# EAGLE design powerSupplyV1 (EAGLE 6.4)
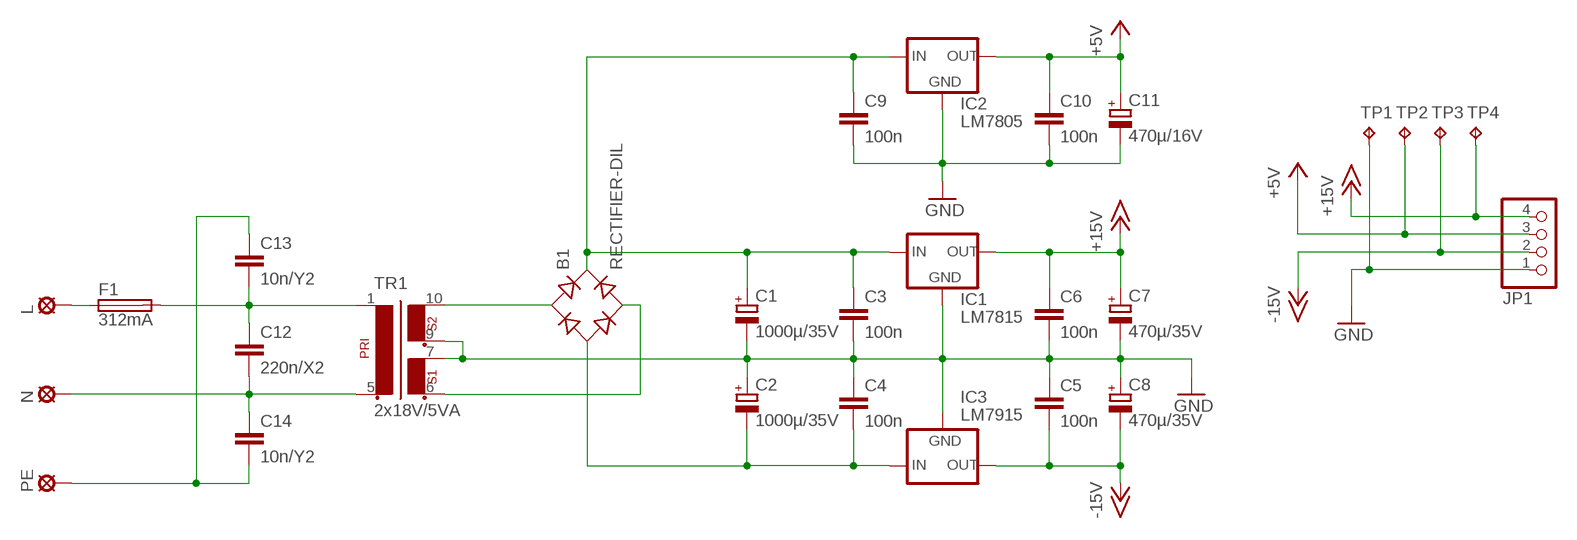
[diagram p0: schematic, sheet 1]

## Parts
B1  RECTIFIER-DIL  [B-DIL]
C1  1000µ/35V  CPOL-EUE5-13  [E5-13]
C2  1000µ/35V  CPOL-EUE5-13  [E5-13]
C3  100n  C-EUC0603K  [C0603K]
C4  100n  C-EUC0603K  [C0603K]
C5  100n  C-EUC0603K  [C0603K]
C6  100n  C-EUC0603K  [C0603K]
C7  470µ/35V  CPOL-EUE5-10.5  [E5-10,5]
C8  470µ/35V  CPOL-EUE5-10.5  [E5-10,5]
C9  100n  C-EUC0603K  [C0603K]
C10  100n  C-EUC0603K  [C0603K]
C11  470µ/16V  CPOL-EUE5-10.5  [E5-10,5]
C12  220n/X2  C-EU225-062X268  [C225-062X268]
C13  10n/Y2  C-EU150-054X183  [C150-054X183]
C14  10n/Y2  C-EU150-054X183  [C150-054X183]
F1  312mA  SH22,5  [SH22,5]
IC1  LM7815  78XXS  [78XXS]
IC2  LM7805  78XXS  [78XXS]
IC3  LM7915  79XXS  [79XXS]
JP1  PINHD-1X4  [1X04]
L  L  SE14  [SE14]
N  SE14  [SE14]
PE  SE14  [SE14]
TP1  TPB2,54  [B2,54]
TP2  TPB2,54  [B2,54]
TP3  TPB2,54  [B2,54]
TP4  TPB2,54  [B2,54]
TR1  2x18V/5VA  EI42-2  [EI42-2]

## Nets
+5V: C10.1 C11.+ IC2.OUT JP1.3 TP2.TP
+15V: C6.1 C7.+ IC1.OUT JP1.4 TP4.TP
-15V: C5.2 C8.- IC3.OUT JP1.2 TP3.TP
GND: C1.- C2.+ C3.2 C4.1 C5.1 C6.2 C7.- C8.+ C9.2 C10.2 C11.- IC1.GND IC2.GND IC3.GND JP1.1 TP1.TP TR1.7 TR1.9
N$1: B1.AC1 TR1.10
N$2: B1.AC2 TR1.6
N$3: C12.1 C13.2 F1.2 TR1.1
N$4: B1.- C2.- C4.2 IC3.IN
N$5: B1.+ C1.+ C3.1 C9.1 IC1.IN IC2.IN
N$6: C12.2 C14.1 N.MP TR1.5
N$7: C13.1 C14.2 PE.MP
N$9: F1.1 L.MP

## Library data of the parts
B1 = rectifier:RECTIFIER-: Rectifier
C1 C2 C7 C8 C11 = rcl:CPOL-EU: POLARIZED CAPACITOR, European symbol
C3-C6 C9 C10 C12-C14 = rcl:C-EU: CAPACITOR, European symbol
F1 = fuse:SH22,5: FUSE HOLDER grid 22,5 mm, OGN0031 8201, Schurter (Buerklin); MF: SCHURTER; MPN: 0031.8201; OC_FARNELL: 1162740; OC_NEWARK: 96F8317
IC1 IC2 = v-reg:78XXS: VOLTAGE REGULATOR
IC3 = v-reg:79XXS: VOLTAGE REGULATOR
JP1 = pinhead:PINHD-1X4: PIN HEADER
L N PE = solpad:SE14: SOLDER PAD E1553, drill 1,4mm, distributor Buerklin, 07F820
TP1-TP4 = testpad:TP: Test pad
TR1 = trafo:EI42-2: TRANSFORMER 1 primary winding, 2 secondary windings ERA

## Board
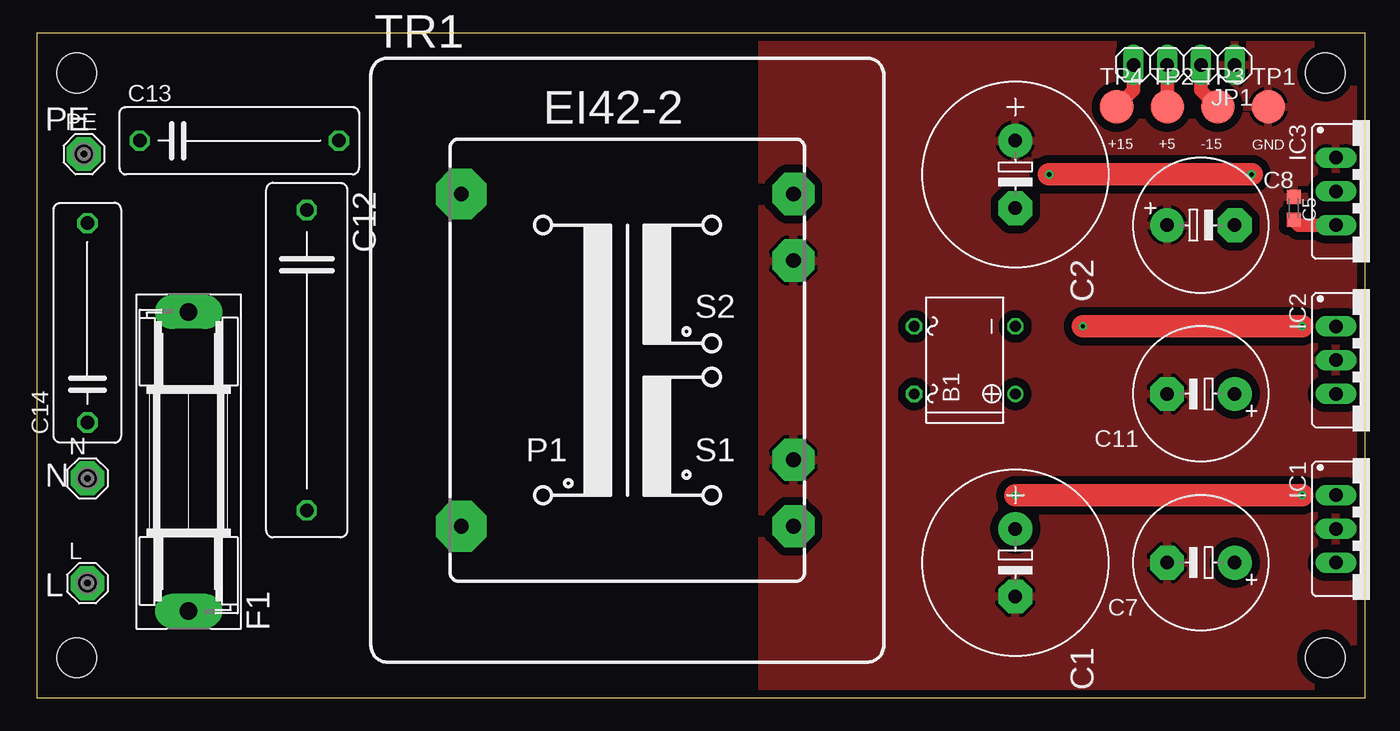
[diagram p1: board, top side]
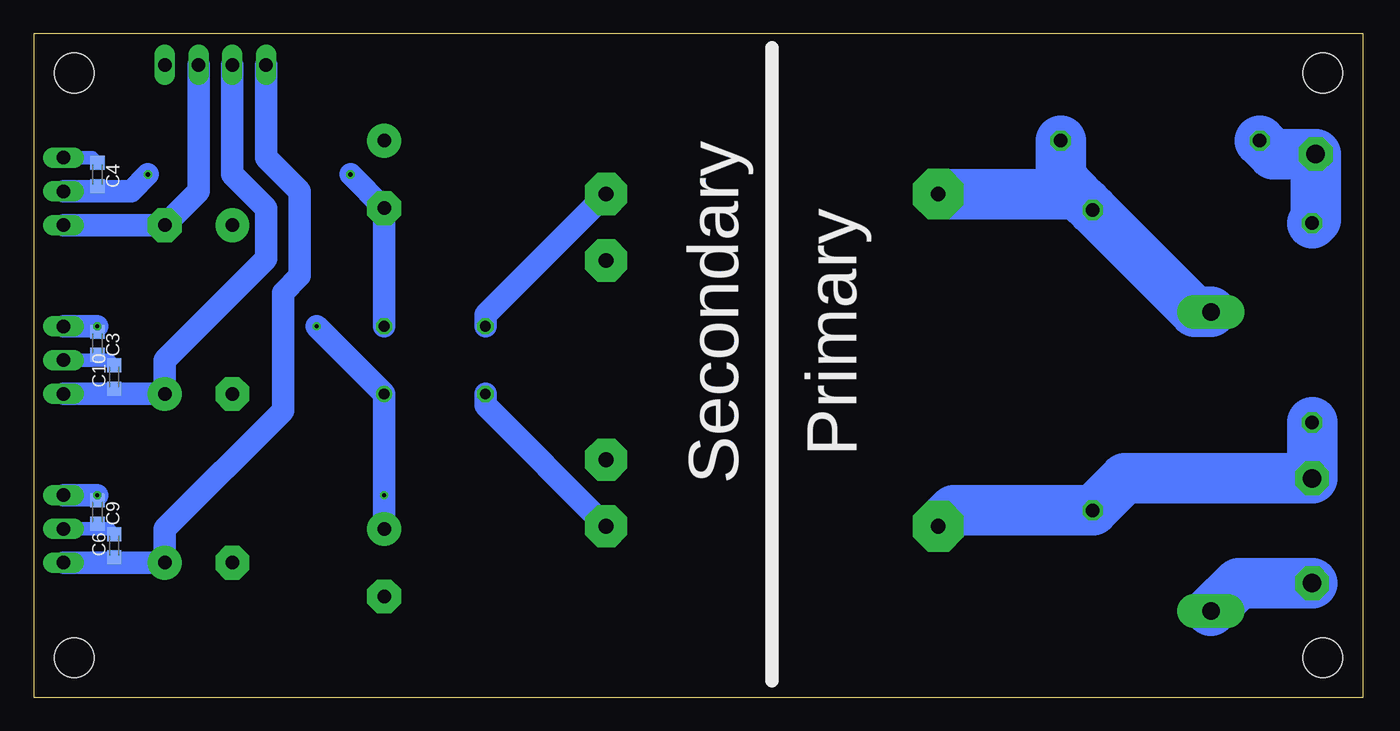
[diagram p2: board, bottom side, seen from below]

Size 100 x 50 mm. Coordinates in mm from the lower left corner, seen from the top.
Outline: 0,0 100,0 100,50 0,50 0,0
Copper layers (1*16): Top 0.035mm / dielectric 1.6mm / Bottom 0.035mm
Design rules "Elecrow_2-layer_PCB_eagle_rule": minimum track width 6mil, minimum drill 12mil, track to track 6mil, track to pad 6mil, pad to pad 6mil, via to via 8mil, smd to smd 0mil, copper to edge 20mil, drill to drill 10mil, minimum pad ring 6mil, minimum via ring 6mil, stop-mask expansion 0mil, vias tented up to drill 100mil, thermal gap 10mil
Holes 3 mm at 3,47 3,3 97,3 97,47

### Footprints (pad centres in the part's own frame; a part is rotated, then mirrored left to right if it is on the bottom)
B-DIL = drill 0.813: + -2.54,-3.81 | drill 0.813 octagon: - 2.54,-3.81; AC1 2.54,3.81; AC2 -2.54,3.81
E5-13 = drill 1.016 pad 2.54: + -2.54,0 | drill 1.016 pad 2.54 octagon: - 2.54,0
C0603K = smd 1.05 x 1.08: 1 -0.875,0; 2 0.875,0
E5-10,5 = drill 1.016 pad 2.54: + -2.54,0 | drill 1.016 pad 2.54 octagon: - 2.54,0
C225-062X268 = drill 1.016 octagon: 1 -11.303,0; 2 11.303,0
C150-054X183 = drill 1.016 octagon: 1 -7.493,0; 2 7.493,0
SH22,5 = drill 1.321 pad 2.54 long: 1 -11.252,0; 2 11.252,0
78XXS = drill 1.016 long: GND 0,-2.54; IN -2.54,-2.54; OUT 2.54,-2.54
79XXS = drill 1.016 long: GND -2.54,-2.54; IN 0,-2.54; OUT 2.54,-2.54
1X04 = drill 1.016 long: 1 -3.81,0; 2 -1.27,0; 3 1.27,0; 4 3.81,0
SE14 = drill 1.397 pad 2.54 octagon: MP 0,0
B2,54 = smd 2.54 x 2.54: TP 0,0
EI42-2 = drill 1.118 pad 3.81 octagon: 1 -12.497,12.497; 5 -12.497,-12.497 | drill 1.118 pad 3.175 octagon: 6 12.497,-12.497; 7 12.497,-7.493; 9 12.497,7.493; 10 12.497,12.497

### Placement (x,y rotation side)
B1  69.85,25.4 90 top
C1  73.66,10.16 270 top
C2  73.66,39.37 270 top
C3  95.25,26.67 270 bottom
C4  95.25,39.37 270 bottom
C5  94.61,36.83 270 top
C6  93.98,11.43 90 bottom
C7  87.63,10.16 180 top
C8  87.63,35.56 0 top
C9  95.25,13.97 270 bottom
C10  93.98,24.13 90 bottom
C11  87.63,22.86 180 top
C12  20.32,25.4 270 top
C13  15.24,41.91 0 top
C14  3.81,28.21 90 top
F1  11.43,17.78 90 top
IC1  100.33,12.7 270 top
IC2  100.33,25.4 270 top
IC3  100.33,38.1 270 top
JP1  86.36,47.62 180 top
L  3.81,8.62 0 top
N  3.81,16.51 0 top
PE  3.54,40.91 0 top
TP1  92.71,44.45 0 top
TP2  85.09,44.45 0 top
TP3  88.9,44.45 0 top
TP4  81.28,44.45 0 top
TR1  44.45,25.4 0 top

### Tracks (layer width: path | path; a pad name or v marks a point on that pad's centre or on a via)
+5V
  Top 1.016: TP2.TP JP1.3
  Bottom 1.016: C10.1 93.98,22.86
  Bottom 1.676: IC2.OUT 93.98,22.86 C11.+ 90.17,25.4 82.55,33.02 82.55,36.83 85.09,39.37 JP1.3
+15V
  Top 1.016: TP4.TP 82.55,45.72 JP1.4
  Bottom 1.016: C6.1 93.98,10.16
  Bottom 1.676: IC1.OUT 93.98,10.16 C7.+ 90.17,12.7 81.28,21.59 81.28,30.48 80.01,31.75 80.01,38.1 82.55,40.64 JP1.4
-15V
  Top 1.016: IC3.OUT 95.01,35.56 C5.2 | TP3.TP 87.63,45.72 JP1.2
  Bottom 1.676: IC3.OUT C8.- 87.63,38.1 JP1.2
GND
  Bottom 1.016: IC2.GND 95.25,25.4 | 95.25,25.4 94.38,25.4 C10.2 | C3.2 95.25,25.4 | IC1.GND 95.25,12.7 | 95.25,12.7 94.38,12.7 C6.2 | C9.2 95.25,12.7 | IC3.GND 95.64,40.64 C4.1
  pour Top (isolate 0.61): 54.61,50.8 101.6,50.8 101.6,-1.27 54.61,-1.27
N$1
  Bottom 1.676: TR1.10 66.04,28.8 B1.AC1
N$2
  Bottom 1.676: TR1.6 66.04,22 B1.AC2
N$3
  Bottom 3.81: F1.2 12.65,29.03 C12.1 20.81,37.19 21.51,37.9 | 21.51,37.9 22.73,39.12 C13.2 | TR1.1 21.51,37.9
N$4  (via drill 0.3)
  Top 1.676: v91.44,39.37 v76.2,39.37
  Bottom 1.016: C4.2 95.25,38.1
  Bottom 1.676: B1.- C2.- v76.2,39.37 | IC3.IN 95.25,38.1 92.71,38.1 v91.44,39.37
N$5  (via drill 0.3)
  Top 1.676: v95.25,15.24 v73.66,15.24 | v95.25,27.94 v78.74,27.94
  Bottom 1.016: C9.1 v95.25,15.24 | C3.1 v95.25,27.94
  Bottom 1.676: C1.+ v73.66,15.24 B1.+ v78.74,27.94 | IC1.IN v95.25,15.24 | IC2.IN v95.25,27.94
N$6
  Bottom 3.81: C14.1 N.MP 17.91,16.51 C12.2 30.76,14.1 TR1.5
N$7
  Bottom 3.81: C13.1 6.75,40.91 PE.MP 3.54,35.97 C14.2
N$9
  Bottom 3.81: L.MP 9.34,8.62 F1.1

### Text on the board
tPlace: +15 | +5 | -15 | PE | GND | N | L
bPlace: Secondary | Primary